# Altium schematic sheet 230V_Inputs.SchDoc
size A; SheetNumber: 3; SheetTotal: 3
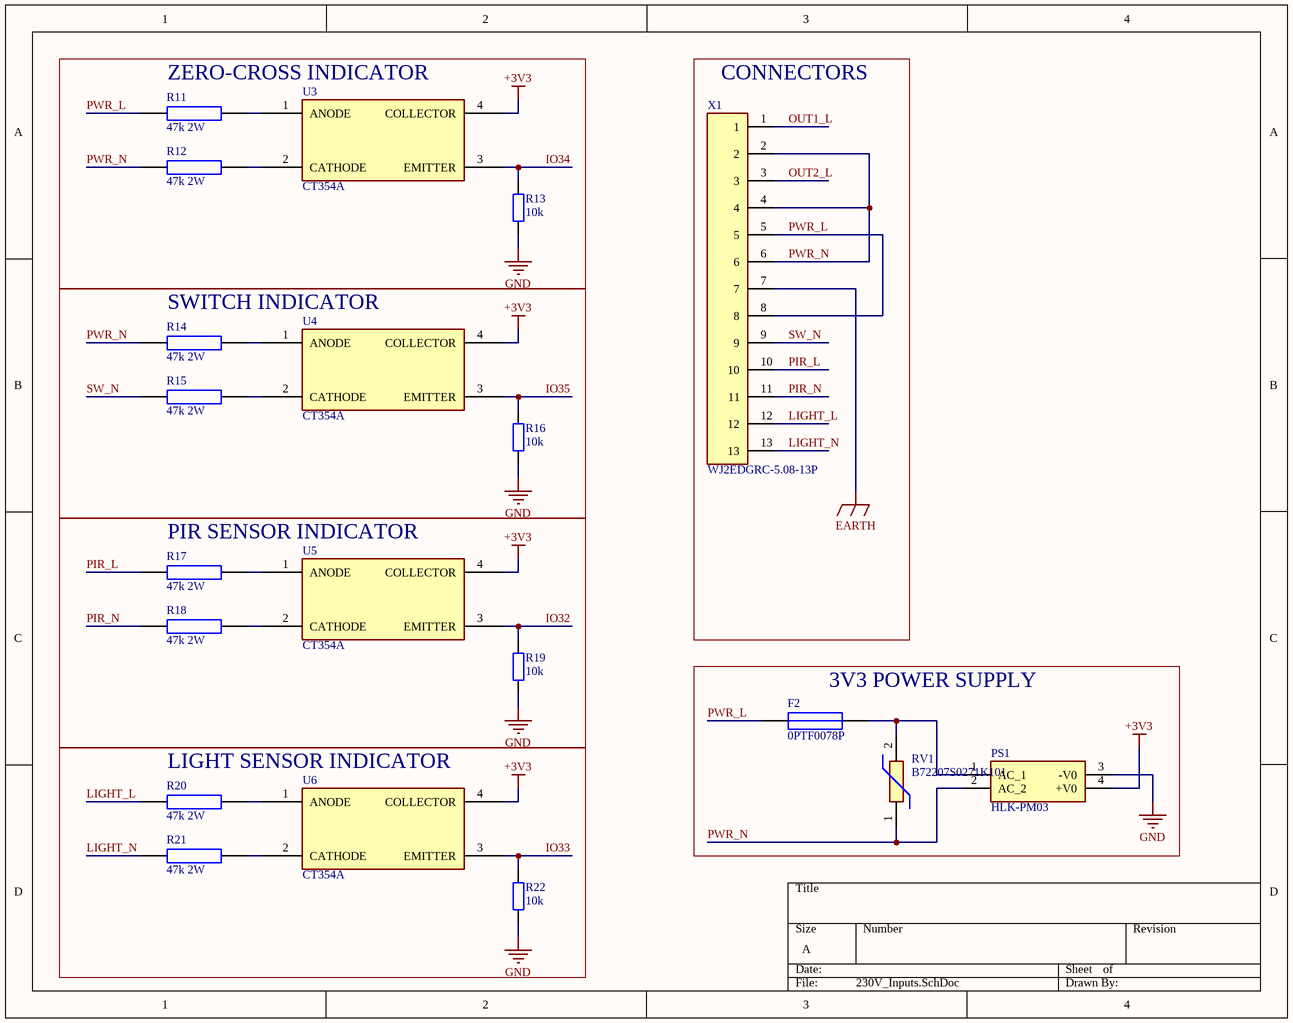
[diagram p0: 230V_Inputs.SchDoc]

## Parts
F2  0PTF0078P  [FH1-200CK-B]
PS1  HLK-PM03  [HLKPM03]
R11  47k 2W  [MFR02SF4702A10]
R12  47k 2W  [MFR02SF4702A10]
R13  10k  [R2012_0805I_N]
R14  47k 2W  [MFR02SF4702A10]
R15  47k 2W  [MFR02SF4702A10]
R16  10k  [R2012_0805I_N]
R17  47k 2W  [MFR02SF4702A10]
R18  47k 2W  [MFR02SF4702A10]
R19  10k  [R2012_0805I_N]
R20  47k 2W  [MFR02SF4702A10]
R21  47k 2W  [MFR02SF4702A10]
R22  10k  [R2012_0805I_N]
RV1  B72207S0271K101  [B72207S0271K101]
U3  CT354A  [CT354A]
U4  CT354A  [CT354A]
U5  CT354A  [CT354A]
U6  CT354A  [CT354A]
X1  WJ2EDGRC-5.08-13P  [WJ2EDGRC-5.08-13P_SLIM]

## Blocks framed on the sheet
ZERO-CROSS INDICATOR: R11-R13 U3
CONNECTORS: X1
SWITCH INDICATOR: R14-R16 U4
PIR SENSOR INDICATOR: R17-R19 U5
3V3 POWER SUPPLY: F2 PS1 RV1
LIGHT SENSOR INDICATOR: R20-R22 U6

## Nets
+3V3: PS1.4(+V0) U3.4(COLLECTOR) U4.4(COLLECTOR) U5.4(COLLECTOR) U6.4(COLLECTOR)
EARTH: X1.7
GND: PS1.3(-V0) R13.1 R16.1 R19.1 R22.1
IO32: R19.2 U5.3(EMITTER)
IO33: R22.2 U6.3(EMITTER)
IO34: R13.2 U3.3(EMITTER)
IO35: R16.2 U4.3(EMITTER)
LIGHT_L: R20.1 X1.12
LIGHT_N: R21.1 X1.13
OUT1_L: X1.1
OUT2_L: X1.3
PIR_L: R17.1 X1.10
PIR_N: R18.1 X1.11
PWR_L: F2.1 R11.1 X1.5 X1.8
PWR_N: PS1.2(AC_2) R12.1 R14.1 RV1.1 X1.2 X1.4 X1.6
SW_N: R15.1 X1.9
NetF2_2: F2.2 PS1.1(AC_1) RV1.2
NetR11_2: R11.2 U3.1(ANODE)
NetR12_2: R12.2 U3.2(CATHODE)
NetR14_2: R14.2 U4.1(ANODE)
NetR15_2: R15.2 U4.2(CATHODE)
NetR17_2: R17.2 U5.1(ANODE)
NetR18_2: R18.2 U5.2(CATHODE)
NetR20_2: R20.2 U6.1(ANODE)
NetR21_2: R21.2 U6.2(CATHODE)

## Library data of the parts
F2 = 0PTF0078P: Fuse holder; Manufacturer_Name: LITTELFUSE; Datasheet Link: https://media.digikey.com/pdf/Data%20Sheets/Littelfuse%20PDFs/PTF075_77_78.pdf; Height: 11.5mm; Manufacturer_Part_Number: 0PTF0078P; Mouser Part Number: 576-0PTF0078P; Mouser Price/Stock: https://www.mouser.co.uk/ProductDetail/Littelfuse/0PTF0078P?qs=Co4VkB5J4%2Fsczy6gG8s%2FsA%3D%3D; Arrow Part Number: 0PTF0078P; Arrow Price/Stock: https://www.arrow.com/en/products/0ptf0078p/littelfuse?region=nac
PS1 = HLK-PM03: Power Supply; Manufacturer_Name: Hi-Link; Datasheet Link: https://datasheet.lcsc.com/szlcsc/1906201102_HI-LINK-HLK-PM03_C209904.pdf; Height: 15mm; Manufacturer_Part_Number: HLK-PM03
R11 R12 R14 R15 R17 R18 R20 R21 = 47k 2W resistor: MFR02SF4702A10
R13 R16 R19 R22 = R: Value: 10k
RV1 = B72207S0271K101: Varistor; Manufacturer_Name: TDK; Datasheet Link: https://product.tdk.com/system/files/dam/doc/product/protection/voltage/lead-disk-varistor/data_sheet/70/db/var/siov_leaded_standard.pdf; Height: 11mm; Manufacturer_Part_Number: B72207S0271K101; Mouser Part Number: 871-B72207S271K101; Mouser Price/Stock: https://www.mouser.co.uk/ProductDetail/EPCOS-TDK/B72207S0271K101?qs=dEfas%2FXlABKLl07P%2FsKndA%3D%3D; Arrow Part Number: B72207S0271K101; Arrow Price/Stock: https://www.arrow.com/en/products/b72207s0271k101/epcos-tdk
X1 = WJ2EDGRC-5.08-13P: 13P 5.08 mm female socket connector